# Altium schematic sheet DigitalCarrierJack.SchDoc
size A4; CompanyName: Technische Hochschule Nürnberg Georg Simon Ohm; Organization: UltraZohm; Address1: Kesslerplatz 12; Address2: 90489 Nürnberg; Address3: GERMANY; Website: www.ultrazohm.com
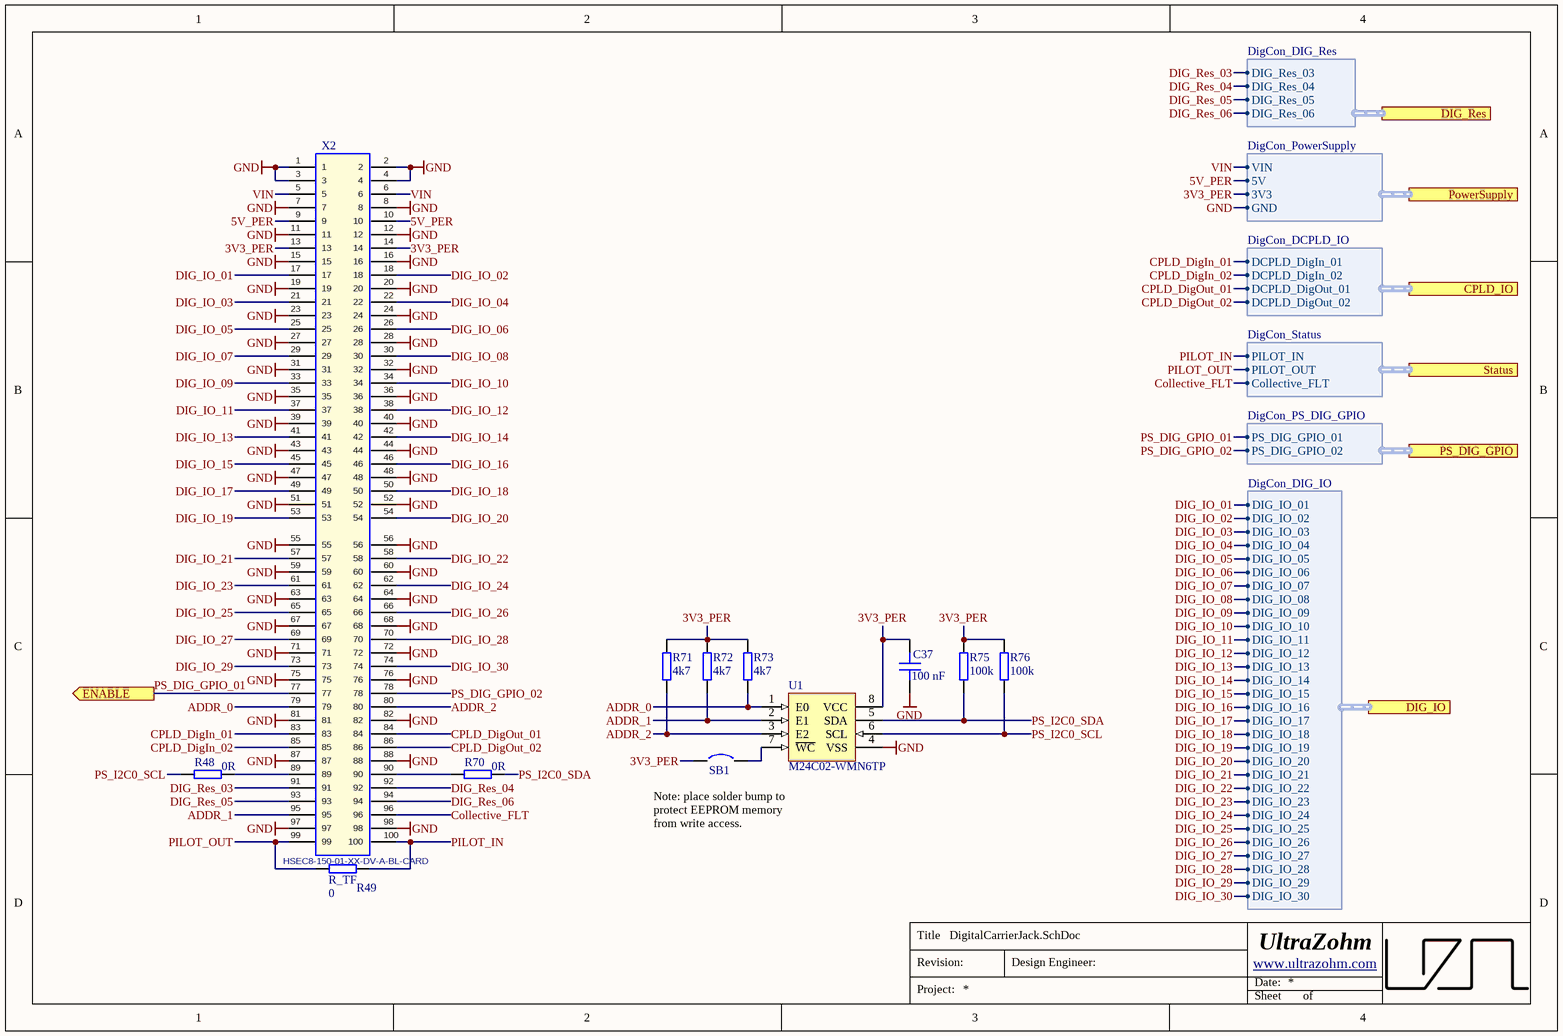
[diagram p0: DigitalCarrierJack.SchDoc]

## Parts
C37  100 nF  [C_0603]
R48  0R  [RES 0603_1608]
R49  R_TF  value 0  [RESC1608X55X30NL15T15]
R70  0R  [RES 0603_1608]
R71  4k7  [RES 0603_1608]
R72  4k7  [RES 0603_1608]
R73  4k7  [RES 0603_1608]
R75  100k  [RES 0603_1608]
R76  100k  [RES 0603_1608]
SB1  Solder Bump 0603  [SB_0603]  (value not drawn)  (no BOM)
U1  M24C02-WMN6TP  [D0008A_N]
X2  HSEC8-150-01-XX-DV-A-BL-CARD  [HSEC8-150-01-XX-DV-A-BL-CARD]  (no BOM)

## Ports
CPLD_IO (harness DigCon_DCPLD_IO), DIG_IO (harness DigCon_DIG_IO), DIG_Res (harness DigCon_DIG_Res), ENABLE (out), PowerSupply (harness DigCon_PowerSupply), PS_DIG_GPIO (harness DigCon_PS_DIG_GPIO), Status (harness DigCon_Status)

## Harnesses
DigCon_PowerSupply: GND, 3V3, 5V, VIN
DigCon_Status: PILOT_IN, PILOT_OUT, Collective_FLT
DigCon_DCPLD_IO: DCPLD_DigIn_01, DCPLD_DigIn_02, DCPLD_DigOut_01, DCPLD_DigOut_02
DigCon_PS_DIG_GPIO: PS_DIG_GPIO_01, PS_DIG_GPIO_02
DigCon_DIG_IO: DIG_IO_01, DIG_IO_02, DIG_IO_03, DIG_IO_04, DIG_IO_05, DIG_IO_06, DIG_IO_07, DIG_IO_08, DIG_IO_09, DIG_IO_10, DIG_IO_11, DIG_IO_12, DIG_IO_13, DIG_IO_14, DIG_IO_15, DIG_IO_16, DIG_IO_17, DIG_IO_18, DIG_IO_19, DIG_IO_20, DIG_IO_21, DIG_IO_22, DIG_IO_23, DIG_IO_24, DIG_IO_25, DIG_IO_26, DIG_IO_27, DIG_IO_28, DIG_IO_29, DIG_IO_30
DigCon_DIG_Res: DIG_Res_03, DIG_Res_04, DIG_Res_05, DIG_Res_06

## Nets
GND: C37.2 U1.4(VSS) X2.1 X2.2 X2.3 X2.4 X2.7 X2.8 X2.11 X2.12 X2.15 X2.16 X2.19 X2.20 X2.23 X2.24 X2.27 X2.28 X2.31 X2.32 X2.35 X2.36 X2.39 X2.40 X2.43 X2.44 X2.47 X2.48 X2.51 X2.52 X2.55 X2.56 X2.59 X2.60 X2.63 X2.64 X2.67 X2.68 X2.71 X2.72 X2.75 X2.76 X2.81 X2.82 X2.87 X2.88 X2.97 X2.98 ; port PowerSupply.GND
3V3_PER: C37.1 R71.2 R72.2 R73.2 R75.2 R76.2 SB1.1 U1.8(VCC) X2.13 X2.14 ; port PowerSupply.3V3
5V_PER: X2.9 X2.10 ; port PowerSupply.5V
ADDR_0: R73.1 U1.1(E0) X2.79
ADDR_1: R72.1 U1.2(E1) X2.95
ADDR_2: R71.1 U1.3(E2) X2.80
Collective_FLT: X2.96 ; port Status.Collective_FLT
CPLD_DigIn_01: X2.83 ; port CPLD_IO.DCPLD_DigIn_01
CPLD_DigIn_02: X2.85 ; port CPLD_IO.DCPLD_DigIn_02
CPLD_DigOut_01: X2.84 ; port CPLD_IO.DCPLD_DigOut_01
CPLD_DigOut_02: X2.86 ; port CPLD_IO.DCPLD_DigOut_02
DIG_IO_01: X2.17 ; port DIG_IO.DIG_IO_01
DIG_IO_02: X2.18 ; port DIG_IO.DIG_IO_02
DIG_IO_03: X2.21 ; port DIG_IO.DIG_IO_03
DIG_IO_04: X2.22 ; port DIG_IO.DIG_IO_04
DIG_IO_05: X2.25 ; port DIG_IO.DIG_IO_05
DIG_IO_06: X2.26 ; port DIG_IO.DIG_IO_06
DIG_IO_07: X2.29 ; port DIG_IO.DIG_IO_07
DIG_IO_08: X2.30 ; port DIG_IO.DIG_IO_08
DIG_IO_09: X2.33 ; port DIG_IO.DIG_IO_09
DIG_IO_10: X2.34 ; port DIG_IO.DIG_IO_10
DIG_IO_11: X2.37 ; port DIG_IO.DIG_IO_11
DIG_IO_12: X2.38 ; port DIG_IO.DIG_IO_12
DIG_IO_13: X2.41 ; port DIG_IO.DIG_IO_13
DIG_IO_14: X2.42 ; port DIG_IO.DIG_IO_14
DIG_IO_15: X2.45 ; port DIG_IO.DIG_IO_15
DIG_IO_16: X2.46 ; port DIG_IO.DIG_IO_16
DIG_IO_17: X2.49 ; port DIG_IO.DIG_IO_17
DIG_IO_18: X2.50 ; port DIG_IO.DIG_IO_18
DIG_IO_19: X2.53 ; port DIG_IO.DIG_IO_19
DIG_IO_20: X2.54 ; port DIG_IO.DIG_IO_20
DIG_IO_21: X2.57 ; port DIG_IO.DIG_IO_21
DIG_IO_22: X2.58 ; port DIG_IO.DIG_IO_22
DIG_IO_23: X2.61 ; port DIG_IO.DIG_IO_23
DIG_IO_24: X2.62 ; port DIG_IO.DIG_IO_24
DIG_IO_25: X2.65 ; port DIG_IO.DIG_IO_25
DIG_IO_26: X2.66 ; port DIG_IO.DIG_IO_26
DIG_IO_27: X2.69 ; port DIG_IO.DIG_IO_27
DIG_IO_28: X2.70 ; port DIG_IO.DIG_IO_28
DIG_IO_29: X2.73 ; port DIG_IO.DIG_IO_29
DIG_IO_30: X2.74 ; port DIG_IO.DIG_IO_30
DIG_Res_03: X2.91 ; port DIG_Res.DIG_Res_03
DIG_Res_04: X2.92 ; port DIG_Res.DIG_Res_04
DIG_Res_05: X2.93 ; port DIG_Res.DIG_Res_05
DIG_Res_06: X2.94 ; port DIG_Res.DIG_Res_06
PILOT_IN: R49.2 X2.100 ; port Status.PILOT_IN
PILOT_OUT: R49.1 X2.99 ; port Status.PILOT_OUT
PS_DIG_GPIO_01: X2.77 ; port ENABLE, port PS_DIG_GPIO.PS_DIG_GPIO_01
PS_DIG_GPIO_02: X2.78 ; port PS_DIG_GPIO.PS_DIG_GPIO_02
PS_I2C0_SCL: R48.1 R76.1 U1.6(SCL)
PS_I2C0_SDA: R70.2 R75.1 U1.5(SDA)
VIN: X2.5 X2.6 ; port PowerSupply.VIN
NetR48_2: R48.2 X2.89
NetR70_1: R70.1 X2.90
NetSB1_2: SB1.2 U1.7(~{WC})

## Notes on the sheet
- Note: place solder bump to protect EEPROM memory from write access.
- Title
- Revision:
- Design Engineer:
- Date:
- Project:
- Sheet
- of

## Library data of the parts
C37 = C0603C104K9PACTU: Capacitor 0603, 6.3 VDC, 100 nF, X5R; Manufacturer: KEMET; Tolerance: 10 %; Voltage Rating: 6.3 VDC; Created from: MGremer; Manufacturer Part Number: C0603C104K9PACTU; PartID: 70; Created On: 20.12.2020 13:54:13; ComponentLink1Description: Datasheet; ComponentLink1URL: https://www.mouser.de/datasheet/2/212/KEM_C1006_X5R_SMD-1103249.pdf; Component Type: Capacitor 0603; Device Package: 0603; Last Updated: 25.01.2024 18:56:23; Mounting Type: SMD; Operating Temperature: -55 - 85°C; Series: SMD Comm X5R; Supplier 1: Mouser; Supplier Part Number 1: 80-C0603C104K9P; Type: Capacitor; Value: 100 nF; Live Cycle Status: 1; Stock number: not stored; LCSC Part Number: C14663
R48 R70 = RC0603JR-070RL: SMD resistor E24 series; Manufacturer: YAGEO; Tolerance: 5%; Created from: MGremer; Manufacturer Part Number: RC0603JR-070RL; PartID: 1; Created On: 14.12.2020 16:17:14; ComponentLink1Description: Datasheet; ComponentLink1URL: https://www.mouser.de/datasheet/2/447/PYu-RC_Group_51_RoHS_L_10-1664068.pdf; Component Type: SMD resistor; Device Package: 0603; Last Updated: 04.03.2021 09:09:42; Mounting Type: SMD; Supplier 1: Mouser; Supplier Part Number 1: 603-RC0603JR-070RL; Supplier 2: LCSC; Supplier Part Number 2: C21189; Type: Resistor; Value: 0R; Live Cycle Status: 1; Stock number: Labor SMD Container; LCSC Part Number: C21189
R49 = R_0.1W_SMD: Standard thick film resistor; MPN: ERJU030R00V; Parameter1: V; Parameter1Desc: Package Method; Parameter2: F; Parameter2Desc: Tolerance Symbol; MaxVoltage: 100; MF: Panasonic; Created: 2019-12-08_Thilo_Wendt; Supplier 1: Mouser; Package: RESC1608X55X30NL15T15; HelpURL: https://www.mouser.de/datasheet/2/315/AOA0000C334-1314047.pdf; Parameter3: *; Parameter3Desc: *; ComponentLink1Description: Datasheet; ComponentLink1URL: https://www.mouser.de/datasheet/2/315/AOA0000C334-1314047.pdf; Supplier Part Number 1: 667-ERJ-U030R00V; LCSC Part Number: C21189
R71-R73 = 0603WAF4701T5E: SMD resistor E24 series; Manufacturer: UNI-ROYAL; Tolerance: 1%; Created from: AGeiger; Manufacturer Part Number: 0603WAF4701T5E; PartID: 90; Created On: 14.12.2020 16:17:14; ComponentLink1Description: Datasheet; ComponentLink1URL: https://datasheet.lcsc.com/lcsc/2206010116_UNI-ROYAL-Uniroyal-Elec-0603WAF4701T5E_C23162.pdf; Component Type: SMD resistor; Device Package: 0603; Last Updated: 25.08.2022 20:03:04; Mounting Type: SMD; Supplier 1: LCSC; Supplier Part Number 1: C23162; Type: Resistor; Value: 4k7; Live Cycle Status: 1; Stock number: Labor SMD Container; LCSC Part Number: C23162
R75 R76 = RK73B1JTTD104J: SMD resistor E24 series; Manufacturer: KOA Speer; Tolerance: 5%; Created from: MGremer; Manufacturer Part Number: RK73B1JTTD104J; PartID: 122; Created On: 14.12.2020 16:17:14; ComponentLink1Description: Datasheet; ComponentLink1URL: https://www.mouser.de/datasheet/2/219/RK73B-1825463.pdf; Component Type: SMD resistor; Device Package: 0603; Last Updated: 27.05.2022 14:04:10; Mounting Type: SMD; Supplier 1: Mouser; Supplier Part Number 1: 660-RK73B1JTTD104J; Type: Resistor; Value: 100k; Live Cycle Status: 1; Stock number: Labor SMD Container; LCSC Part Number: C25803
SB1 = =Value: Created from: AGeiger; Revision: July-2002: Re-released for DXP Platform.; PartID: 1; Created On: 09.01.2024 17:13:56; Component Type: Solder Bump; Device Package: 0603; Last Updated: 09.01.2024 17:13:56; Manufacturer Part Number: Solder Bump 0603; Mounting Type: SMD; Value: Solder Bump 0603
U1 = M24C02-WMN6TP: 2Kbit I2C SOP-8 EEPROM ROHS; Manufacturer: STMicroelectronics; Created from: AGeiger; Manufacturer Part Number: M24C02-WMN6TP; PartID: 1; Created On: 19.11.2023 14:54:27; ComponentLink1Description: Datasheet; ComponentLink1URL: https://www.st.com/resource/en/datasheet/m24c01-w.pdf; Component Type: EEPROM; Device Package: SOIC-8; Last Updated: 19.11.2023 21:39:04; Mounting Type: SMD; Operating Temperature: -40 to +85 °C; Series: M24xxx; Supplier 1: Mouser; Supplier Part Number 1: 511-M24C02-WMN6TP; Supplier 2: LCSC; Supplier Part Number 2: C7562; Type: Memory; Value: M24C02-WMN6TP; LCSC Part Number: C7562
X2 = HSEC8-150-01-XX-DV-A-BL-CARD: Mating Card Layout for HSEC8-150-01-XX-DV-A-BL; Manufacturer: SAMTEC; Created: 2018_04_23_AGeiger; Value: HSEC8-150-01-XX-DV-A-BL-CARD